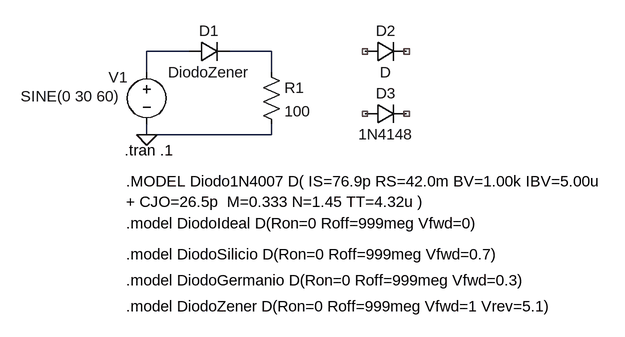
[diagram p0: schematic Tutorial_LTSpice_Ep3-Diodo.asc]
Tutorial_LTSpice_Ep3-Diodo.asc, the LTspice schematic file:
Version 4
SHEET 1 880 680
WIRE 144 96 80 96
WIRE 272 96 208 96
WIRE 80 128 80 96
WIRE 272 128 272 96
WIRE 80 224 80 208
WIRE 272 224 272 208
WIRE 272 224 80 224
FLAG 80 224 0
SYMBOL voltage 80 112 R0
WINDOW 0 -59 24 Left 2
WINDOW 3 -194 53 Left 2
WINDOW 123 0 0 Left 0
WINDOW 39 0 0 Left 0
SYMATTR InstName V1
SYMATTR Value SINE(0 30 60)
SYMBOL diode 144 112 R270
WINDOW 0 32 32 VTop 2
WINDOW 3 0 32 VBottom 2
SYMATTR InstName D1
SYMATTR Value DiodoZener
SYMBOL res 256 112 R0
SYMATTR InstName R1
SYMATTR Value 100
SYMBOL diode 416 112 R270
WINDOW 0 32 32 VTop 2
WINDOW 3 0 32 VBottom 2
SYMATTR InstName D2
SYMBOL diode 416 208 R270
WINDOW 0 32 32 VTop 2
WINDOW 3 0 32 VBottom 2
SYMATTR InstName D3
SYMATTR Value 1N4148
TEXT 46 248 Left 2 !.tran .1
TEXT 48 296 Left 2 !.MODEL Diodo1N4007 D( IS=76.9p RS=42.0m BV=1.00k IBV=5.00u\n+ CJO=26.5p  M=0.333 N=1.45 TT=4.32u )
TEXT 48 360 Left 2 !.model DiodoIdeal D(Ron=0 Roff=999meg Vfwd=0)
TEXT 48 408 Left 2 !.model DiodoSilicio D(Ron=0 Roff=999meg Vfwd=0.7)
TEXT 48 448 Left 2 !.model DiodoGermanio D(Ron=0 Roff=999meg Vfwd=0.3)
TEXT 48 488 Left 2 !.model DiodoZener D(Ron=0 Roff=999meg Vfwd=1 Vrev=5.1)

The netlist it stands for:
* Tutorial_LTSpice_Ep3-Diodo.asc
V1 N001 0 SINE(0 30 60)
D1 N001 N002 DiodoZener
R1 N002 0 100
D2 NC_01 NC_02 D
D3 NC_03 NC_04 1N4148
.model D D
.lib standard.dio
.tran .1
.MODEL Diodo1N4007 D( IS=76.9p RS=42.0m BV=1.00k IBV=5.00u
+ CJO=26.5p  M=0.333 N=1.45 TT=4.32u )
.model DiodoIdeal D(Ron=0 Roff=999meg Vfwd=0)
.model DiodoSilicio D(Ron=0 Roff=999meg Vfwd=0.7)
.model DiodoGermanio D(Ron=0 Roff=999meg Vfwd=0.3)
.model DiodoZener D(Ron=0 Roff=999meg Vfwd=1 Vrev=5.1)
.backanno
.end